# EasyEDA Pro project ProPrj_队内赛第二版_2024-09-21_20-05-29_2024-09-27.epro, board PCB1
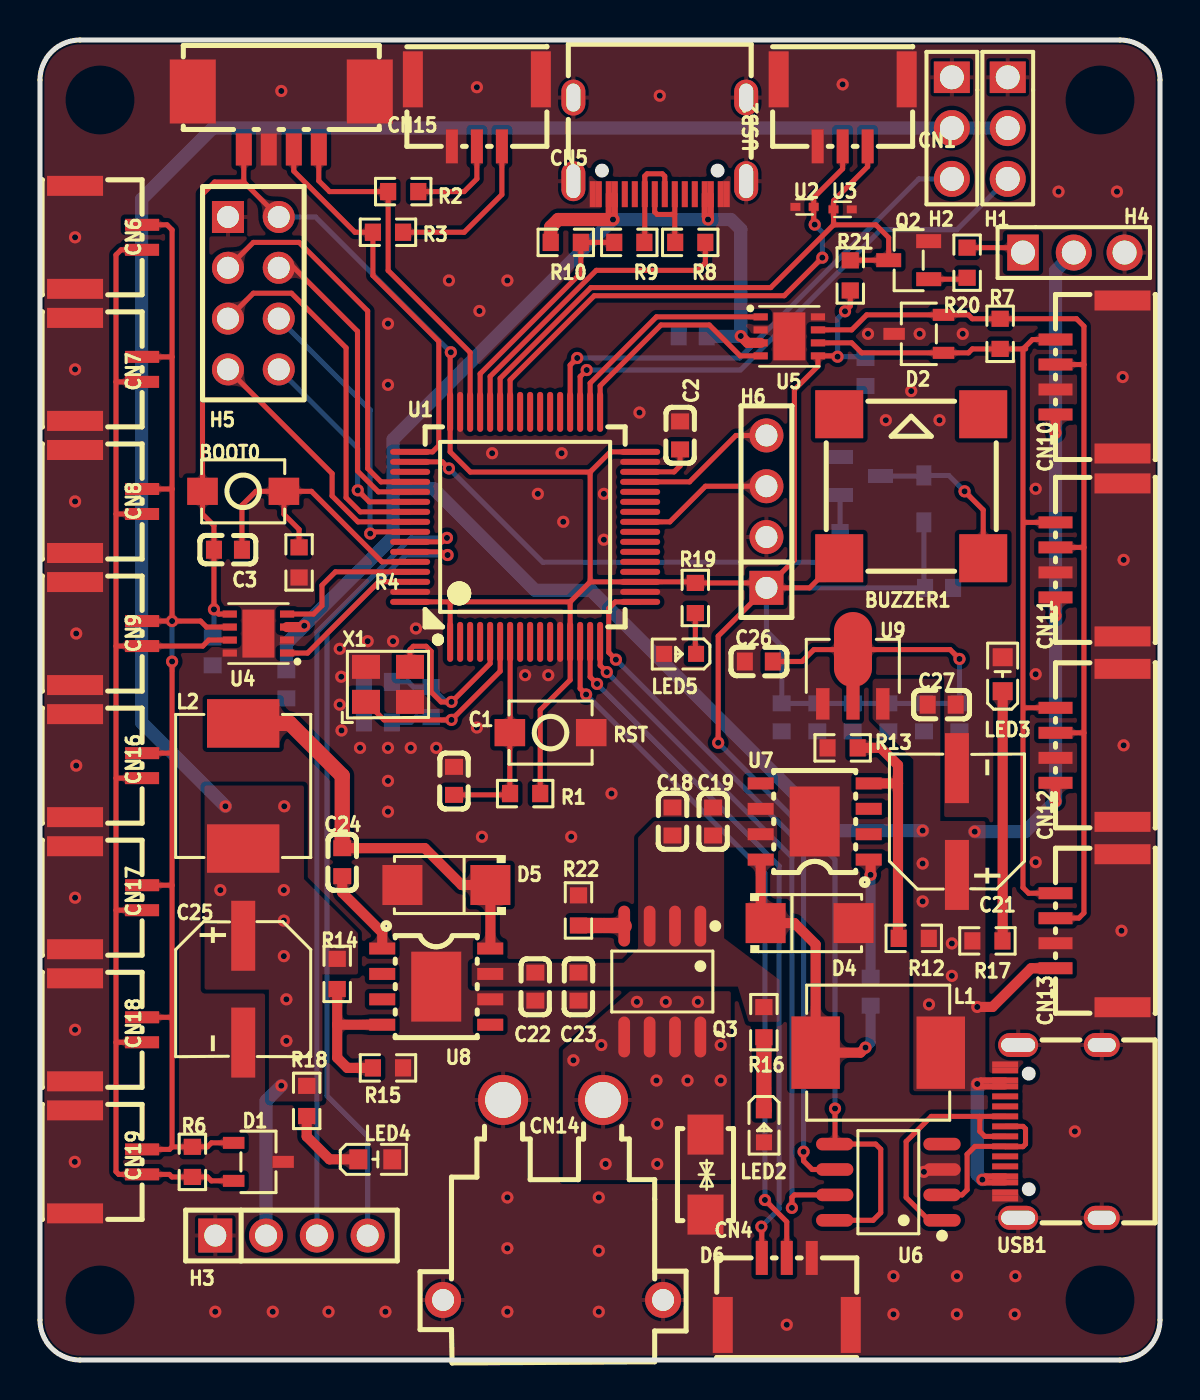
[diagram p1: board, top side]
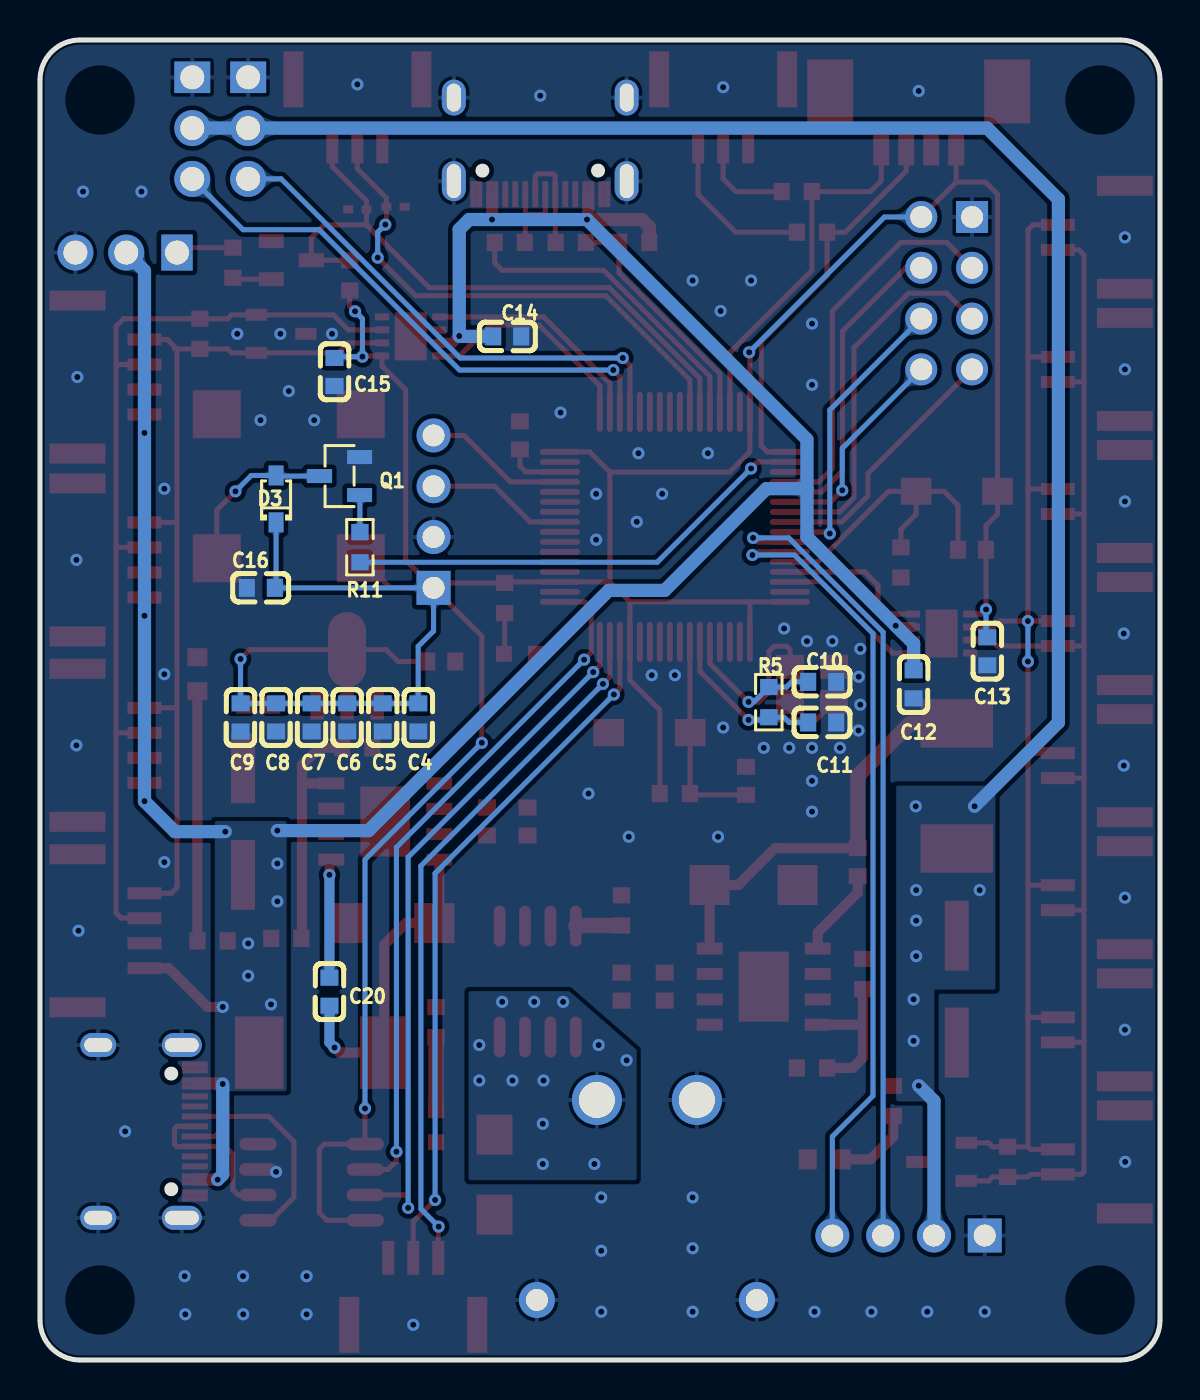
[diagram p2: board, bottom side, seen from below]

Outline 56 x 66 mm; copper layers: Top Layer, Inner1, Inner2, Inner3, Inner4, Inner5, Inner6, Inner7, Inner8, Inner9, Inner10, Inner11, Inner12, Inner13, Inner14, Inner15, Inner16, Inner17, Inner18, Inner19, Inner20, Inner21, Inner22, Inner23, Inner24, Inner25, Inner26, Inner27, Inner28, Inner29, Inner30, Bottom Layer. Coordinates in mm from the lower left corner of the outline.
Outline path: 0,64 0,2 arc(0.59,0.59) 2,0 54,0 arc(55.41,0.59) 56,2 56,64 arc(55.41,65.41) 54,66 2,66 arc(0.59,65.41) 0,64
Stack: Top Layer 0.035mm / Dielectric1 1.51mm FR4 er 4.5 / Bottom Layer 0.035mm

## Design rules (mm)
net OSC_IN: OSC
net OSC_OUT: OSC
net UART2_TX: UART2
net UART2_RX: UART2
net UART4_TX: UART4
net UART4_RX: UART4
net OLED_SCL: OLED
net OLED_SDA: OLED
net UART3_RX: UART3
net UART3_TX: UART3
net CAN1_TX: CAN1
net CAN1_RX: CAN1
net CAN2_TX: CAN2
net CAN2_RX: CAN2
template: 自定义配置
spacing copperThickness1oz (default): track to track 0.102, other pairs 0.152 to 0.3
spacing copperThickness2oz: track to track 0.203, other pairs 0.152 to 0.3
track width copperThickness1oz (default): min 0.127, default 0.254, max 2.54
track width copperThickness2oz: min 0.203, default 0.254, max 2.54
differential pair differentialPair (default): width min 0.127, default 0.254, max 2.54; gap min 0.152, default 0.152
via viaSize (default): diameter min 0.5, default 0.61, max 10; hole min 0.3, default 0.305, max 6.299

## Placement (name value [footprint] x y rotation side)
BOOT0  -  [Key_SMD_3x4x2]  10.16 43.43 0 top
BUZZER1  2.7kHz  [BUZ-SMD_4P-L8.5-W8.5-P8.50-BR]  43.56 43.69 0 top
C1  1uF  [C0603]  20.7 28.96 90 top
C2  22uF  [C0603]  32 46.23 270 top
C3  100nF  [C0603]  9.4 40.51 0 top
C4  100nF  [C0603]  37.08 32.13 90 bottom
C5  100nF  [C0603]  38.86 32.13 90 bottom
C6  100nF  [C0603]  40.64 32.13 90 bottom
C7  100nF  [C0603]  42.42 32.13 90 bottom
C8  100nF  [C0603]  44.2 32.13 90 bottom
C9  100nF  [C0603]  45.97 32.13 90 bottom
C10  20pF  [C0603]  16.89 33.91 180 bottom
C11  20pF  [C0603]  16.89 31.88 180 bottom
C12  100nF  [C0603]  12.32 33.78 90 bottom
C13  100nF  [C0603]  8.64 35.43 270 bottom
C14  100nF  [C0603]  32.64 51.18 0 bottom
C15  100nF  [C0603]  41.28 49.4 270 bottom
C16  100nF  [C0603]  44.96 38.61 180 bottom
C18  4.7uF  [C0603]  31.62 26.92 270 top
C19  4.7uF  [C0603]  33.66 26.92 270 top
C20  0.01uF  [C0603]  41.53 18.42 270 bottom
C21  220uF  [CAP-SMD_BD6.3-L6.6-W6.6-FD]  45.85 26.92 90 top
C22  4.7uF  [C0603]  24.76 18.67 90 top
C23  4.7uF  [C0603]  26.92 18.67 90 top
C24  0.01uF  [C0603]  15.11 24.89 90 top
C25  220uF  [CAP-SMD_BD6.3-L6.6-W6.6-FD]  10.16 18.54 270 top
C26  10uF  [C0603]  35.94 34.92 180 top
C27  10uF  [C0603]  45.09 32.77 0 top
CN1  A1257WV-S-3P  [CONN-SMD_A1257WV-S-3P]  40.13 62.36 180 top
CN4  A1257WV-S-3P  [CONN-SMD_A1257WV-S-3P]  37.34 3.43 0 top
CN5  A1257WV-S-3P  [CONN-SMD_A1257WV-S-3P]  21.84 62.36 180 top
CN6  A1257WV-S-2P-LCP  [CONN-SMD_A1257WV-S-2P]  3.43 56.13 270 top
CN7  A1257WV-S-2P-LCP  [CONN-SMD_A1257WV-S-2P]  3.43 49.53 270 top
CN8  A1257WV-S-2P-LCP  [CONN-SMD_A1257WV-S-2P]  3.43 42.93 270 top
CN9  A1257WV-S-2P-LCP  [CONN-SMD_A1257WV-S-2P]  3.43 36.32 270 top
CN10  A1257WV-S-4P-LCP  [CONN-SMD_A1257WV-S-4P]  52.45 49.15 90 top
CN11  A1257WV-S-4P-LCP  [CONN-SMD_A1257WV-S-4P]  52.45 40 90 top
CN12  A1257WV-S-4P-LCP  [CONN-SMD_A1257WV-S-4P]  52.45 30.73 90 top
CN13  A1257WV-S-4P-LCP  [CONN-SMD_A1257WV-S-4P]  52.45 21.46 90 top
CN14  XT30PW-M  [CONN-TH_XT30PW-M]  25.65 8 0 top
CN15  532610471  [CONN-SMD_4P-P1.25_53261-0471]  12.06 61.98 180 top
CN16  A1257WV-S-2P-LCP  [CONN-SMD_A1257WV-S-2P]  3.43 29.72 270 top
CN17  A1257WV-S-2P-LCP  [CONN-SMD_A1257WV-S-2P]  3.43 23.11 270 top
CN18  A1257WV-S-2P-LCP  [CONN-SMD_A1257WV-S-2P]  3.43 16.51 270 top
CN19  A1257WV-S-2P-LCP  [CONN-SMD_A1257WV-S-2P]  3.43 9.91 270 top
D1  PESD1CAN  [SOT-23-3_L2.9-W1.6-P1.90-LS2.8-BR]  10.92 9.91 180 top
D2  PESD1CAN  [SOT-23-3_L2.9-W1.6-P1.90-LS2.8-BR]  43.94 51.31 0 top
D3  1N4148WS  [SOD-323_L1.8-W1.3-LS2.5-RD]  44.2 43.05 90 bottom
D4  B340A-E3/61T  [SMA_L4.3-W2.6-LS5.2-RD]  38.48 21.84 0 top
D5  B340A-E3/61T  [SMA_L4.3-W2.6-LS5.2-RD]  20.32 23.75 180 top
D6  SMAJ28CA  [SMA_L4.4-W2.6-LS5.0-BI]  33.27 9.27 90 top
H1  2.54-1*3P针  [HDR-TH_3P-P2.54-V-M-1]  48.39 61.59 270 top
H2  2.54-1*3P针  [HDR-TH_3P-P2.54-V-M-1]  45.59 61.59 270 top
H3  2.54-1*4P母  [HDR-TH_4P-P2.54-V-F]  12.57 6.22 0 top
H4  2.54-1*3P针  [HDR-TH_3P-P2.54-V-M-1]  51.69 55.37 0 top
H5  PM254V-12-08-H85  [HDR-TH_8P-P2.54-V-F-R2-C4-S2.54]  10.67 53.34 270 top
H6  2.54-1*4P母  [HDR-TH_4P-P2.54-V-F]  36.32 42.42 90 top
L1  22uH  [IND-SMD_L7.0-W6.6_FXL0630]  41.91 15.37 180 top
L2  22uH  [IND-SMD_L7.0-W6.6_FXL0630]  10.16 28.7 90 top
LED2  NCD0603R1  [LED0603-RD_RED]  36.19 11.68 270 top
LED3  NCD0603G1  [LED0603-RD_1]  48.13 34.29 90 top
LED4  NCD0603G1  [LED0603-RD_1]  16.76 10.03 0 top
LED5  NCD0603B1  [LED0603-RD]  32 35.31 180 top
Q1  SS8050  [SOT-23-3_L2.9-W1.3-P1.90-LS2.4-BR]  41.02 44.2 180 bottom
Q2  SS8050  [SOT-23-3_L2.9-W1.3-P1.90-LS2.4-BR]  43.43 54.99 0 top
Q3  AO4441  [SOIC-8_L4.9-W3.9-P1.27-LS6.0-BL]  31.12 18.92 180 top
R1  10K  [R0603]  24.26 28.32 0 top
R2  20R  [R0603]  18.16 58.42 0 top
R3  20R  [R0603]  17.4 56.39 0 top
R4  10K  [R0603]  12.95 39.88 270 top
R5  4.7K  [R0603]  19.56 32.89 90 bottom
R6  120R  [R0603]  7.62 9.91 270 top
R7  120R  [R0603]  48.01 51.31 90 top
R8  20R  [R0603]  32.51 55.88 0 top
R9  20R  [R0603]  29.46 55.88 180 top
R10  4.7K  [R0603]  26.29 55.88 0 top
R11  1K  [R0603]  40 40.64 90 bottom
R12  100K  [R0603]  43.69 21.08 0 top
R13  32.4K  [R0603]  40.13 30.61 0 top
R14  100K  [R0603]  14.86 19.3 90 top
R15  32.4K  [R0603]  17.4 14.61 180 top
R16  4.7K  [R0603]  36.19 16.89 90 top
R17  1K  [R0603]  47.37 20.95 180 top
R18  1K  [R0603]  13.34 12.95 90 top
R19  1K  [R0603]  32.77 38.1 90 top
R20  4.7K  [R0603]  46.35 54.86 270 top
R21  4.7K  [R0603]  40.51 54.23 270 top
R22  4.7K  [R0603]  26.92 22.48 270 top
RST  -  [Key_SMD_3x4x2]  25.53 31.37 180 top
U1  STM32F446RET6  [LQFP-64_L10.0-W10.0-P0.50-LS12.0-BL]  24.26 41.66 0 top
U2  ESD9B5.0ST5G  [SOD-923_L0.8-W0.6-LS1.0-BI]  38.23 57.66 0 top
U3  ESD9B5.0ST5G  [SOD-923_L0.8-W0.6-LS1.0-BI]  40.13 57.53 180 top
U4  TJA1044GTK/3Z  [HVSON-8_L3.0-W3.0-P0.65-BL-EP]  10.92 36.32 90 top
U5  TJA1044GTK/3Z  [HVSON-8_L3.0-W3.0-P0.65-BL-EP]  37.47 51.18 270 top
U6  CH340N  [SOP-8_L4.9-W3.9-P1.27-LS6.0-BL]  42.42 8.89 90 top
U7  TPS5430DDAR  [ESOP-8_L4.9-W3.9-P1.27-LS6.0-TL-EP]  38.74 26.92 180 top
U8  TPS5430DDAR  [ESOP-8_L4.9-W3.9-P1.27-LS6.0-TL-EP]  19.81 18.67 0 top
U9  AMS1117-3.3  [SOT-89_L4.5-W2.5-P1.50-LS4.2-BR]  40.64 34.16 270 top
USB1  -  [USB_TYPE-C-16P]  50.67 11.3 90 top
USB2  -  [USB_TYPE-C-16P]  31.12 60.71 180 top
X1  12MHz  [OSC-SMD_4P-L3.2-W2.5-BL]  17.4 33.78 0 top

## Footprints (pads in the part's own frame, mm; a bottom-side part is the same pattern mirrored in y, then rotated)
BUZ-SMD_4P-L8.5-W8.5-P8.50-BR
  rect 2.4x2.4 smd: 1(-3.6,-3.6) 2(3.6,-3.6) 3(3.599,3.599) 4(-3.6,3.6)
C0603
  rect 0.8x0.9 smd: 1(-0.7,0) 2(0.7,0)
CAP-SMD_BD6.3-L6.6-W6.6-FD
  rect 3.5x1.2 smd: 1(-2.67,0) 2(2.67,0)
CONN-SMD_4P-P1.25_53261-0471
  rect 0.8x1.6 smd: 1(-1.875,1.45) 2(-0.625,1.45) 3(0.625,1.45) 4(1.875,1.45)
  rect 2.3x3.2 smd: 5(4.425,-1.45) 6(-4.425,-1.45)
CONN-SMD_A1257WV-S-2P
  rect 0.6x1.7 smd: 1(0.625,1.675) 2(-0.625,1.675)
  rect 1x2.8 smd: 3(2.575,-1.675) 4(-2.575,-1.675)
CONN-SMD_A1257WV-S-3P
  rect 0.6x1.7 smd: 1(1.25,1.675) 2(0,1.675) 3(-1.25,1.675)
  rect 1x2.8 smd: 4(3.2,-1.675) 5(-3.2,-1.675)
CONN-SMD_A1257WV-S-4P
  rect 0.6x1.7 smd: 1(1.875,1.675) 2(0.625,1.675) 3(-0.625,1.675) 4(-1.875,1.675)
  rect 1x2.8 smd: 5(3.825,-1.675) 6(-3.825,-1.675)
CONN-TH_XT30PW-M
  round 2.5 hole 1.8: 1(-2.5,5) 2(2.5,5)
  round 1.8 hole 1.1: 3(5.5,-5) 4(-5.5,-5)
ESOP-8_L4.9-W3.9-P1.27-LS6.0-TL-EP
  rect 1.3x0.6 smd: 1(-2.7,1.905) 2(-2.7,0.635) 3(-2.7,-0.635) 4(-2.7,-1.905) 5(2.7,-1.905) 6(2.7,-0.635) 7(2.7,0.635) 8(2.7,1.905)
  rect 2.5x3.5 smd: 9(0,0)
HDR-TH_3P-P2.54-V-M-1
  rect 1.575x1.8 hole 1.2: 1(-2.54,0)
  round 1.8 hole 1.2: 2(0,0) 3(2.54,0)
HDR-TH_4P-P2.54-V-F
  rect 1.7x1.7 hole 1.1: 1(-3.81,0)
  round 1.7 hole 1.1: 2(-1.27,0) 3(1.27,0) 4(3.81,0)
HDR-TH_8P-P2.54-V-F-R2-C4-S2.54
  rect 1.6x1.6 hole 1.1: 1(-3.81,-1.27)
  round 1.6 hole 1.1: 2(-3.81,1.27) 3(-1.27,-1.27) 4(-1.27,1.27) 5(1.27,-1.27) 6(1.27,1.27) 7(3.81,-1.27) 8(3.81,1.27)
HVSON-8_L3.0-W3.0-P0.65-BL-EP
  rect 0.355x0.711 smd: 1(-0.975,-1.433) 2(-0.325,-1.433) 3(0.325,-1.433) 4(0.975,-1.433) 5(0.975,1.433) 6(0.325,1.433) 7(-0.325,1.433) 8(-0.975,1.433)
  rect 2.4x1.6 smd: 9(0,0)
IND-SMD_L7.0-W6.6_FXL0630
  rect 2.424x3.62 smd: 1(3.128,0) 2(-3.128,0)
Key_SMD_3x4x2
  rect 1.53x1.36 smd: 1(-2.035,0) 2(2.035,0)
LED0603-RD
  rect 0.8x0.8 smd: 1(-0.799,0) 2(0.799,0)
LED0603-RD_1
  rect 0.9x1 smd: 1(-0.85,0) 2(0.85,0)
LED0603-RD_RED
  rect 0.8x0.8 smd: 1(-0.799,-0.004) 2(0.799,0.004)
LQFP-64_L10.0-W10.0-P0.50-LS12.0-BL
  oval 0.3x2 smd: 1(-3.75,-5.75) 2(-3.25,-5.75) 3(-2.75,-5.75) 4(-2.25,-5.75) 5(-1.75,-5.75) 6(-1.25,-5.75) 7(-0.75,-5.75) 8(-0.25,-5.75) 9(0.25,-5.75) 10(0.75,-5.75) 11(1.25,-5.75) 12(1.75,-5.75) 13(2.25,-5.75) 14(2.75,-5.75) 15(3.25,-5.75) 16(3.75,-5.75) 33(3.75,5.75) 34(3.25,5.75) 35(2.75,5.75) 36(2.25,5.75) 37(1.75,5.75) 38(1.25,5.75) 39(0.75,5.75) 40(0.25,5.75) 41(-0.25,5.75) 42(-0.75,5.75) 43(-1.25,5.75) 44(-1.75,5.75) 45(-2.25,5.75) 46(-2.75,5.75) 47(-3.25,5.75) 48(-3.75,5.75)
  oval 2x0.3 smd: 17(5.75,-3.75) 18(5.75,-3.25) 19(5.75,-2.75) 20(5.75,-2.25) 21(5.75,-1.75) 22(5.75,-1.25) 23(5.75,-0.75) 24(5.75,-0.25) 25(5.75,0.25) 26(5.75,0.75) 27(5.75,1.25) 28(5.75,1.75) 29(5.75,2.25) 30(5.75,2.75) 31(5.75,3.25) 32(5.75,3.75) 49(-5.75,3.75) 50(-5.75,3.25) 51(-5.75,2.75) 52(-5.75,2.25) 53(-5.75,1.75) 54(-5.75,1.25) 55(-5.75,0.75) 56(-5.75,0.25) 57(-5.75,-0.25) 58(-5.75,-0.75) 59(-5.75,-1.25) 60(-5.75,-1.75) 61(-5.75,-2.25) 62(-5.75,-2.75) 63(-5.75,-3.25) 64(-5.75,-3.75)
OSC-SMD_4P-L3.2-W2.5-BL
  rect 1.4x1.2 smd: 1(-1.1,-0.875) 2(1.1,-0.875) 3(1.1,0.875) 4(-1.1,0.875)
R0603
  rect 0.806x0.864 smd: 1(-0.753,0) 2(0.753,0)
SMA_L4.3-W2.6-LS5.2-RD
  rect 2x2 smd: 1(-2.2,0) 2(2.2,0)
SMA_L4.4-W2.6-LS5.0-BI
  rect 2x1.8 smd: 1(-2,0) 2(2,0)
SOD-323_L1.8-W1.3-LS2.5-RD
  rect 1x0.75 smd: 1(-1.173,0) 2(1.173,0)
SOD-923_L0.8-W0.6-LS1.0-BI
  rect 0.5x0.4 smd: 1(-0.457,0) 2(0.457,0)
SOIC-8_L4.9-W3.9-P1.27-LS6.0-BL
  oval 0.588x2.045 smd: 1(-1.905,-2.772) 2(-0.635,-2.772) 3(0.635,-2.772) 4(1.905,-2.772) 5(1.905,2.772) 6(0.635,2.772) 7(-0.635,2.772) 8(-1.905,2.772)
SOP-8_L4.9-W3.9-P1.27-LS6.0-BL
  oval 0.63x1.865 smd: 1(-1.905,-2.683) 2(-0.635,-2.683) 3(0.635,-2.683) 4(1.905,-2.683) 5(1.905,2.683) 6(0.635,2.683) 7(-0.635,2.683) 8(-1.905,2.683)
SOT-23-3_L2.9-W1.3-P1.90-LS2.4-BR
  rect 1.25x0.7 smd: 1(1,-0.95) 2(1,0.95) 3(-1,0)
SOT-23-3_L2.9-W1.6-P1.90-LS2.8-BR
  rect 1.07x0.6 smd: 1(1.235,-0.95) 2(1.235,0.95) 3(-1.235,0)
SOT-89_L4.5-W2.5-P1.50-LS4.2-BR
  rect 1.575x0.672 smd: 1(1.356,-1.5) 3(1.356,1.5)
  custom 5.377x1.9 smd: 2(-1.356,0.009)
USB_TYPE-C-16P
  oval 1.2x2 hole 0.7x1.7: 1(-4.193,1.765) 2(4.447,1.765)
  oval 1.2x1.8 hole 0.7x1.4: 3(-4.193,-2.415) 4(4.447,-2.415)
  rect 0.3x1.3 smd: A1(-3.223,2.415) A4(-2.423,2.415) A5(-1.123,2.415) A6(-0.123,2.415) A7(0.377,2.415) A8(1.377,2.415) A9(2.677,2.415) A12(3.477,2.415) B1(3.177,2.415) B4(2.377,2.415) B5(1.877,2.415) B6(0.877,2.415) B7(-0.623,2.415) B8(-1.623,2.415) B9(-2.123,2.415) B12(-2.923,2.415)

## Nets
As in the schematic, except:
GND: C1.2 C2.1 C4.1 C5.1 C6.1 C7.1 C8.1 C9.1 C10.2 C11.2 C12.1 C13.2 C14.1 C15.2 C16.1 C18.1 C19.1 C21.2 C22.1 C23.1 C25.2 C26.2 C27.2 CN1.1 CN1.4 CN1.5 CN4.1 CN4.4 CN4.5 CN5.1 CN5.4 CN5.5 CN6.3 CN6.4 CN7.3 CN7.4 CN8.3 CN8.4 CN9.3 CN9.4 CN10.3 CN10.5 CN10.6 CN11.3 CN11.5 CN11.6 CN12.3 CN12.5 CN12.6 CN13.3 CN13.5 CN13.6 CN14.1 CN14.3 CN14.4 CN15.3 CN15.5 CN15.6 CN16.3 CN16.4 CN17.3 CN17.4 CN18.3 CN18.4 CN19.3 CN19.4 D1.3 D2.3 D4.2 D5.2 D6.1 H1.1 H2.1 H3.1 H4.3 H5.1 H6.2 LED2.2 LED3.2 LED4.2 LED5.2 Q1.2 Q2.2 R4.2 R13.1 R15.1 R22.1 RST.1 U1.12 U1.18 U1.31 U1.47 U1.63 U2.1 U3.1 U4.2 U4.8 U4.9 U5.2 U5.8 U5.9 U6.3 U7.6 U7.9 U8.6 U8.9 U9.1 USB1.1 USB1.2 USB1.3 USB1.4 USB1.A1 USB1.A12 USB1.B1 USB1.B12 USB2.1 USB2.2 USB2.3 USB2.4 USB2.A1 USB2.A12 USB2.B1 USB2.B12 X1.2 X1.4
VCC3V3: BOOT0.1 BUZZER1.1 C3.1 C4.2 C5.2 C6.2 C7.2 C8.2 C9.2 C13.1 C15.1 C16.2 C26.1 CN15.4 D3.1 H5.2 H6.1 R1.2 R19.2 R21.2 U1.1 U1.13 U1.19 U1.32 U1.48 U1.64 U4.5 U5.5 U6.5 U6.8 U9.2
BOOT0: BOOT0.2 C3.2 R4.1 U1.60
RESET: C1.1 R1.1 RST.2 U1.7

Pads without a net: BUZZER1 3 4; U6 4; U7 2 3 5; U8 2 3 5; USB1 A5 A8 B5 B8; USB2 A5 A8 B5 B8

## Via types
v1: diameter 0.61, hole 0.305, Top Layer to Bottom Layer, 146 vias

## Routing (per net, layer and track width the routed paths; a pad name or vN(x,y) marks a point on that pad's centre or on a via; arc(x,y) is an arc through that point)
5V_U: length 84.7
  Bottom Layer w0.66: v1(9.27,27.69) 5.08,31.88 5.08,58.04 8.64,61.59 H2.2 H1.2 ; v1(12.06,13.72) 11.3,12.95 H3.2
  vias: v1(9.02,23.5) v1(12.21,27.69) v1(12.19,23.5) v1(12.19,21.97) v1(12.19,20.19) v1(12.32,18.03) v1(12.32,15.95)
+5V: length 138
  Top Layer w0.305: USB2.A9 28.44,57.23 v1(28.65,57.02) 28.74,57.11 USB2.B4 ; USB2.B9 33.24,57.19 v1(33.4,57.02) 33.54,57.16 USB2.A4 ; USB1.B9 47.28,9.18 v1(47.12,9.02) 47.25,8.88 USB1.A4 ; USB1.B4 46.99,13.68 v1(46.86,13.8) 47.04,13.98 USB1.A9
  Top Layer w0.508: U4.3 13.15,36.65 v1(13.21,36.71) ; U5.3 35.38,50.86 v1(35.04,51.2) ; CN10.4 v1(50.78,46.36) ; CN13.4 49.56,19.59 47.62,17.65 v1(46.86,17.65) ; CN12.4 v1(50.78,27.94) ; CN11.4 v1(50.78,37.21)
  Top Layer w0.66: R10.1 25.54,56.65 25.91,57.02 v1(28.65,57.02)
  Bottom Layer w0.66: C12.2 12.32,35.82 v1(13.21,36.71) 17.65,41.15 17.65,43.57 ; v1(46.74,26.42) 49.25,26.42 v1(50.78,27.94) v1(50.78,37.21) v1(50.78,46.36) 50.78,54.46 H4.2 ; 17.65,43.57 19.68,43.57 24.76,38.48 27.56,38.48 39.57,26.47 v1(44.13,26.47) ; 17.65,43.57 17.65,46.03 v1(28.65,57.02) v1(33.4,57.02) 34.54,57.02 35.04,56.53 v1(35.04,51.2) 35.02,51.18 C14.2 ; v1(47.12,9.02) 46.86,9.27 v1(46.86,13.8)
  vias: v1(44.13,24.82) v1(44.13,22.93) v1(44.45,17.78) v1(45.59,20.83) v1(45.59,19.21)
GND:
  vias: v1(1.74,9.91) v1(1.75,56.14) v1(1.75,49.53) v1(1.75,42.93) v1(1.81,36.32) v1(1.81,29.72) v1(1.75,23.12) v1(1.75,16.51) v1(8.76,2.41) v1(11.64,2.41) v1(12.06,63.45) v1(14.43,2.41) v1(14.99,35.56) v1(14.99,32.77) v1(15.06,34.16) v1(15.08,31.48) v1(16,30.61) v1(16.38,35.94) v1(17.27,2.41) v1(17.4,51.82) v1(17.4,48.76) v1(17.4,30.61) v1(17.4,28.96) v1(17.4,27.42) v1(17.65,35.94) v1(18.54,30.61) v1(18.8,36.58) v1(19.81,30.61) v1(20.45,53.97) v1(21.84,63.64) v1(21.84,31.62) v1(21.97,52.45) v1(22.1,26.16) v1(22.61,45.34) v1(23.37,53.97) v1(23.37,8.13) v1(23.37,5.59) v1(23.37,2.41) v1(24.26,34.24) v1(24.89,43.31) v1(25.41,34.24) v1(26.08,45.34) v1(26.16,41.91) v1(26.56,26.16) v1(27.94,8.13) v1(27.94,5.46) v1(27.94,2.41) v1(28.19,43.31) v1(28.19,41.01) v1(28.57,28.32) v1(29.97,47.37) v1(30.99,63.22) v1(37.34,1.76) v1(40.13,63.78) v1(41.4,51.31) v1(42.29,46.99) v1(42.67,4.19) v1(42.67,2.29) v1(43.56,48.45) v1(43.98,51.31) v1(44.2,9.41) v1(44.97,46.99) v1(45.85,4.19) v1(45.84,2.29) v1(46.14,51.31) v1(48.74,2.29) v1(48.77,4.19) v1(49.78,43.56) v1(49.78,34.29) v1(49.78,24.89) v1(50.93,58.42) v1(51.74,11.43) v1(53.85,58.42) v1(54.13,49.15) v1(54.08,21.46) v1(54.18,40) v1(54.18,30.73)
VCC3V3: length 192.9
  Top Layer w0.254: R1.2 25.01,32.5 26.51,34 U1.13 26.51,37.91 ; H6.1 33.91,36.19 v1(33.91,30.86) ; H6.1 37.72,40 37.72,48.51 38.9,49.69 U5.5 39.84,50.21 v1(39.88,50.17) ; H6.1 38.48,38.61 BUZZER1.1 ; H6.1 36.08,38.85 R19.2 32.71,38.91 U1.19 27.51,38.91 ; 10.19,58.9 8.73,58.9 8.12,58.29 BOOT0.1 8.12,42.29 8.7,41.72 C3.1 v1(8.7,37.53) 8.93,37.3 U4.5 ; 10.19,58.9 CN15.4 ; 10.19,58.9 H5.2 ; U1.64 20.51,37.91 ; 20.51,37.91 26.51,37.91 ; 20.51,37.91 U1.1 ; U1.32 28.51,45.41 27.51,44.4 ; v1(39.75,12.57) 39.75,10.81 U6.5 41.78,10.79 42.04,10.54 42.04,7.37 41.66,6.99 U6.8 ; 26.51,37.91 27.51,38.91 ; 27.51,38.91 27.51,44.4 ; v1(45.97,35.05) 45.51,35.52 38.69,35.52 38.1,34.92 C26.1 ; v1(40.25,52.43) 40.51,52.7 R21.2 ; 27.51,44.4 21.51,44.4 20.51,45.41 U1.48 20.51,50.35 v1(20.54,50.39)
  Bottom Layer w0.254: v1(40.25,52.43) 39.88,52.06 v1(39.88,50.17) 41.21,50.17 C15.1 ; v1(33.91,30.86) 39.75,25.02 v1(39.75,12.57) ; v1(20.54,50.39) 13.78,57.15 H5.2 ; v1(45.97,35.05) C9.2 C8.2 C7.2 C6.2 C5.2 C4.2 37.09,32.84 37.09,35.68 36.32,36.45 H6.1 C16.2 44.2,38.67 D3.1 ; 8.64,36.13 8.7,36.19 v1(8.7,37.53)
BAT:
  vias: v1(26.67,14.99) v1(28.07,15.75) v1(28.28,9.8) v1(29.84,17.91) v1(30.82,13.97) v1(30.86,11.81) v1(30.86,9.8) v1(31.29,17.91) v1(32.38,13.97) v1(32.89,17.91) v1(34.04,15.75) v1(34.04,13.97)
BOOT0: length 15.5
  Top Layer w0.254: U1.60 17.1,39.91 13.57,43.43 BOOT0.2 ; BOOT0.2 10.79,43.43 10.1,42.74 C3.2 ; BOOT0.2 12.19,42.29 12.95,41.53 R4.1
BUZZER: length 23.6
  Top Layer w0.254: v1(20.45,44.58) 20.12,44.91 U1.50
  Bottom Layer w0.254: v1(20.45,44.58) 25.14,39.89 R11.1
C10: length 2.9
  Top Layer w0.254: C2.2 32,44.7 31.71,44.41 U1.30
CAN1_H: length 65.7
  Top Layer w0.254: U4.7 8.44,36 8.14,35.7 CN9.1 3.8,35.7 ; CN19.1 3.94,9.28 3.8,9.42 3.8,15.89 ; 3.8,15.89 3.8,22.49 ; 3.8,15.89 CN18.1 ; 3.8,48.91 3.8,55.25 4.05,55.51 CN6.1 ; 3.8,48.91 CN7.1 ; 3.8,48.91 3.8,42.3 ; CN16.1 3.8,29.09 ; 3.8,29.09 3.8,22.49 ; 3.8,29.09 3.8,35.7 ; 3.8,22.49 CN17.1 ; 3.8,35.7 3.8,42.3 ; 3.8,42.3 CN8.1 ; 5.11,9.28 6.47,9.28 6.6,9.15 R6.2 8.37,9.15 8.57,8.96 9.69,8.96
CAN1_L: length 64.2
  Top Layer w0.254: 7.62,10.66 6.6,10.66 ; 6.6,10.66 6.6,17.14 ; 6.6,10.66 6.48,10.53 CN19.2 ; CN18.2 6.6,17.14 ; 6.6,17.14 6.6,23.74 ; CN17.2 6.6,23.74 ; 6.6,23.74 6.6,30.34 ; 6.6,50.16 6.6,43.55 ; 6.6,50.16 CN7.2 ; 6.6,50.16 6.6,56.5 6.35,56.76 CN6.2 ; 6.6,43.55 v1(6.6,36.95) ; 6.6,43.55 CN8.2 ; v1(6.6,34.92) 6.6,30.34 ; 6.6,30.34 CN16.2 ; v1(6.6,36.95) CN9.2 ; v1(6.6,36.95) 8.03,36.95 8.33,36.65 U4.6 ; 9.69,10.86 8.57,10.86 8.37,10.66 R6.1
  Bottom Layer w0.254: v1(6.6,36.95) v1(6.6,34.92)
CAN1_RX: length 7.6
  Top Layer w0.254: U1.61 14.77,39.41 14.1,38.73 14.1,37.72 13.68,37.3 U4.4
CAN1_TX: length 7.6
  Top Layer w0.254: U1.62 18.5,38.91 16.94,38.91 13.38,35.35 U4.1
CAN2_H: length 49
  Top Layer w0.254: 52.2,40.63 52.2,31.36 ; 52.2,40.63 52.2,49.77 ; 52.2,40.63 CN11.2 ; 52.2,31.36 52.2,22.35 51.94,22.1 50.79,22.1 CN13.2 ; 52.2,31.36 CN12.2 ; 52.2,49.77 52.2,51.69 51.82,52.06 R7.2 46.62,52.06 46.42,52.26 41.34,52.26 40.58,51.51 U5.7 ; 52.2,49.77 CN10.2
CAN2_L: length 43.9
  Top Layer w0.254: CN11.1 49.28,41.88 ; 50.65,23.34 49.43,23.34 49.15,23.62 49.15,50.55 49.16,50.55 ; 49.16,50.55 49.28,50.55 ; 49.16,50.55 49.63,51.02 50.65,51.02 ; 49.16,50.55 R7.1 46.62,50.55 46.42,50.36 41.08,50.36 40.58,50.86 U5.6 ; CN12.1 49.28,32.61
CAN2_RX: length 11.2
  Top Layer w0.254: U5.4 35.01,50.21 33.47,51.75 31.05,51.75 28.01,48.71 U1.33
CAN2_TX: length 11.3
  Top Layer w0.254: U5.1 30.82,52.16 27.51,48.84 U1.34
CE: length 19.2
  Top Layer w0.254: U1.52 17.05,43.91 16.38,44.58 16.38,52.45 12.95,55.88 10.67,55.88 H5.3
CSN: length 15.3
  Top Layer w0.254: U1.53 16.92,43.41 15.88,44.45 15.88,51.44 12.7,54.61 H5.4
DN: length 4.4
  Top Layer w0.254: 31.74,57.28 USB2.B7 ; 31.74,57.28 31.74,55.9 R8.1 ; 31.74,57.28 30.86,57.28 30.73,57.4 30.73,58.29 USB2.A7
DP: length 5.3
  Top Layer w0.254: R9.1 30.24,55.9 USB2.B6 30.24,59.19 30.35,59.31 31.12,59.31 31.24,59.19 31.24,58.29
IRQ: length 10.5
  Top Layer w0.254: v1(15.89,43.48) 16.47,42.91 U1.54
  Bottom Layer w0.254: v1(15.89,43.48) 15.89,45.58 H5.8
OLED_SCL: length 40.5
  Top Layer w0.254: v1(20.35,41.11) 20.31,41.11 20.11,40.91 U1.58
  Bottom Layer w0.254: v1(20.35,41.11) 18.56,41.11 13.84,36.39 H3.3
OLED_SDA: length 40.5
  Top Layer w0.254: U1.59 20.06,40.41 20.21,40.25 v1(20.38,40.25)
  Bottom Layer w0.254: H3.4 16.38,11.18 14.35,13.21 14.35,36.32 18.28,40.25 v1(20.38,40.25)
OSC_IN: length 12.6
  Top Layer w0.254: U1.5 22.51,34.83 20.59,32.9 v1(20.57,32.9) 20.05,32.9 19.56,33.4 19.56,35.43 19.3,35.69 18.67,35.69 18.5,35.52 X1.3
  Bottom Layer w0.254: 17.59,33.91 18.41,33.91 18.68,33.65 R5.2 20.3,32.9 v1(20.57,32.9)
OSC_OUT: length 12.7
  Top Layer w0.254: U1.6 23.01,34.44 v1(20.57,32) 17.2,32 X1.1
  Bottom Layer w0.254: v1(20.57,32) 19.69,32 R5.1 18.8,32.14 18.54,31.88 17.59,31.88
RESET: length 10.4
  Top Layer w0.254: C1.1 23.44,28.26 R1.1 23.49,28.33 RST.2 23.51,31.38 U1.7
SERVO0: length 27.2
  Top Layer w0.254: v1(27.34,49.5) 27.01,49.17 U1.35
  Bottom Layer w0.254: 48.39,59.06 45.85,56.52 42.04,56.52 35.02,49.5 v1(27.34,49.5)
SERVO1: length 25.3
  Top Layer w0.254: v1(26.86,50.1) 26.51,49.75 U1.36
  Bottom Layer w0.254: 45.59,59.06 43.94,59.06 34.99,50.1 v1(26.86,50.1)
SPI1_MISO: length 12.9
  Top Layer w0.254: U1.56 15.9,41.91 14.6,43.2 14.6,44.32 H5.7
SPI1_MOSI: length 14.7
  Top Layer w0.254: v1(16.51,41.32) 16.51,41.4 16.51,41.41 U1.57
  Bottom Layer w0.254: v1(16.51,41.32) 16.51,47.5 H5.6
SPI1_SCK: length 18.6
  Top Layer w0.254: U1.55 16.01,42.41 15.3,43.12 15.3,50.61 12.57,53.34 10.67,53.34 H5.5
SWCLK: length 19.9
  Top Layer w0.254: U1.49 19.62,45.41 19.94,45.72 19.94,50.93 16.65,54.22 R3.1 15.75,56.39 12.69,59.45 CN15.2
SWDIO: length 18
  Top Layer w0.254: U1.46 21.51,50.38 17.41,54.47 R2.1 14.48,58.42 13.94,58.96 CN15.1
TTL_DM: length 8.1
  Top Layer w0.254: USB1.A7 49.15,11.68 49.28,11.56 49.28,10.79 49.15,10.67 48.27,10.67 USB1.B7 46.75,10.68 46.35,10.29 46.35,8.51 46.1,8.25 U6.2
TTL_DP: length 12.7
  Top Layer w0.254: USB1.A6 47.24,11.18 46.99,11.43 46.99,12.18 ; 46.99,12.18 USB1.B6 ; 46.99,12.18 44.56,12.18 43.31,10.92 43.31,8.13 44.45,6.99 U6.1
UART1_RX: length 32.2
  Top Layer w0.254: 39.68,56.76 36.54,53.62 27.54,53.62 23.01,49.08 U1.43 ; 39.68,56.76 U3.2 39.68,57.96 41.38,59.67 CN1.3 ; 39.68,56.76 41.79,56.76 42.43,56.12 Q2.3 40.52,54.99 R21.1
UART1_TX: length 26.1
  Top Layer w0.254: CN1.2 40.13,59.56 38.68,58.11 U2.2 38.68,56.82 v1(38.74,56.77) ; U1.42 23.51,49.01 27.71,53.21 37.21,53.21 v1(39.12,55.12)
  Bottom Layer w0.254: v1(38.74,56.77) 39.12,56.39 v1(39.12,55.12)
UART2_RX: length 35.1
  Top Layer w0.254: v1(38.18,10.41) 38.18,9.95 38.61,9.53 U6.6 ; v1(28.79,35.02) 28.44,35.38 28.44,37.58 28.76,37.91 U1.17
  Bottom Layer w0.254: v1(38.18,10.41) 38.18,25.63 v1(28.79,35.02)
UART2_TX: length 35
  Top Layer w0.254: v1(28.34,34.4) 28.01,34.73 U1.16 ; U6.7 37.72,8.25 37.59,8.13 v1(37.59,7.61)
  Bottom Layer w0.254: v1(28.34,34.4) 37.59,25.14 v1(37.59,7.61)
UART3_RX: length 7.1
  Top Layer w0.254: H6.3 33.27,43.69 31.49,41.91 U1.25
UART3_TX: length 7.3
  Top Layer w0.254: H6.4 34.8,46.23 32.48,43.91 U1.29
UART4_RX: length 35.1
  Top Layer w0.254: v1(27.85,33.81) 27.51,34.15 U1.15 ; CN4.3 36.09,6.65 v1(36.07,6.67)
  Bottom Layer w0.254: v1(36.07,6.67) 36.96,7.56 36.96,24.7 v1(27.85,33.81)
UART4_TX: length 35.1
  Top Layer w0.254: CN4.2 37.34,6.91 v1(36.25,8) ; v1(27.31,33.27) 27.01,33.57 U1.14
  Bottom Layer w0.254: v1(36.25,8) 36.25,24.33 v1(27.31,33.27)
USB_DM: length 15.9
  Top Layer w0.254: U1.44 22.51,49.18 27.81,54.48 32.89,54.48 33.27,54.86 R8.2
USB_DP: length 12.2
  Top Layer w0.254: R9.2 R10.2 27.04,54.35 22.01,49.31 U1.45
$1N4999: length 4.8
  Top Layer w0.254: CN5.2 21.84,59.06 21.21,58.42 R2.2
$1N5000: length 8.1
  Top Layer w0.254: CN5.3 23.09,58.27 21.21,56.39 R3.2
$1N5113: length 8.3
  Top Layer w0.254: v1(46.23,43.43) 47.16,42.5 BUZZER1.2
  Bottom Layer w0.254: Q1.3 44.17,44.2 D3.2 45.44,44.23 v1(46.23,43.43)
$1N5118: length 1.9
  Bottom Layer w0.254: R11.2 40,43.23 Q1.1
$1N5172: length 5.9
  Top Layer w0.508: U7.1 41.53,24.92 v1(41.53,24.26)
  Bottom Layer w0.508: C20.1 v1(41.53,24.26)
$1N5173: length 16.4
  Top Layer w0.508: U7.8 36.03,22.09 D4.1 37.72,21.84 38.78,20.78 L1.1 41.02,15.37 v1(41.28,15.62)
  Bottom Layer w0.508: v1(41.28,15.62) 41.53,15.88 C20.2
$1N5178: length 12.5
  Top Layer w0.508: 42.9,28.83 42.9,21.12 R12.1 ; 42.9,28.83 41.44,28.83 ; 42.9,28.83 42.9,29.74 42.04,30.61 R13.2
$1N5180: length 4.4
  Top Layer w0.508: U8.1 17.11,21.37 15.11,23.37 C24.1
$1N5181: length 21
  Top Layer w0.508: C24.2 19.24,25.59 21.08,23.75 D5.1 22.52,20.58 U8.8
  Top Layer w0.762: C24.2 15.11,29.21 12.49,31.83 L2.1
$1N5186: length 7.7
  Top Layer w0.508: 14.86,16.76 U8.4 ; 14.86,16.76 14.86,15.11 15.37,14.61 R15.2 ; 14.86,16.76 R14.1
$1N5187: length 3.7
  Top Layer w0.762: R16.1 36.19,12.49 LED2.1
$1N5190: length 12.5
  Top Layer w0.508: LED3.1 48.13,20.96 R17.1
$1N5193: length 4.1
  Top Layer w0.508: LED4.1 14.48,10.03 13.34,11.18 R18.1
$1N5196: length 2.1
  Top Layer w0.254: LED5.1 32.77,35.34 R19.1
$1N5202: length 1.9
  Top Layer w0.254: R20.2 46.29,54.04 Q2.1
$1N5203: length 2.9
  Top Layer w0.254: R20.1 48.9,55.62 H4.1
$1N5213: length 2.3
  Top Layer w0.762: Q3.4 29.18,21.73 R22.2

## Copper pours and planes (outline as drawn; the poured copper is in the pictures)
5V_U on Top Layer: 13.17,28.7 13.17,24.04 15.88,21.34 15.88,19.3 14.1,19.3 14.1,12.95 11.47,12.95 11.47,18.54 8.25,18.54 8.25,28.7 8.25,28.7
5V_U on Bottom Layer: 8.25,28.7 13.16,28.7 13.16,12.95 11.3,12.95 11.3,18.54 8.25,18.54 8.25,28.7
+5V on Top Layer: 43.69,13.46 47.24,13.46 47.24,26.92 44.99,26.92 44.99,34.04 41.66,34.04 41.66,32.06 43.69,30.03
+5V on Bottom Layer: 43.69,26.92 47.24,26.92 47.24,13.46 43.69,13.46 43.69,26.92
GND on Top Layer: 0,66.17 56.13,66.17 56.13,0 0,0
GND on Bottom Layer: 0,66.17 56.13,66.17 56.13,0 0,0
VCC on Top Layer: 29.19,19.83 29.93,20.57 29.93,26.12 30.73,26.92 36.83,26.92 36.83,25.65 34.18,25.65 34.18,21.08 36.96,18.99 36.96,16.93 35.45,16.93 34.91,18.69 21.61,18.69 21.61,19.83
BAT on Top Layer: 29.51,18.42 34.51,18.42 34.51,9.02 26.16,9.02 26.16,15.49
BAT on Bottom Layer: 29.54,18.42 34.54,18.42 34.54,9.02 26.19,9.02 26.19,15.49

Small or netless copper shapes (teardrops, artwork), in the pictures only: 238 on Top Layer, 75 on Bottom Layer
